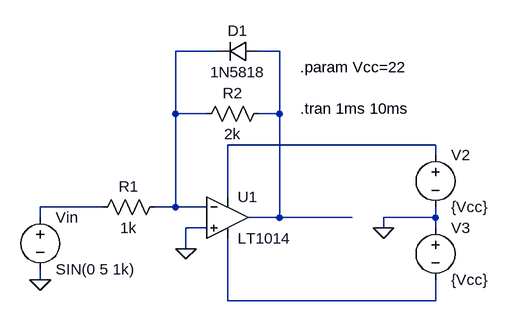
[diagram p0: schematic scheme2.asc]
scheme2.asc, the LTspice schematic file:
Version 4.1
SHEET 1 880 680
WIRE 176 -48 112 -48
WIRE 272 -48 240 -48
WIRE 112 48 112 -48
WIRE 160 48 112 48
WIRE 272 48 272 -48
WIRE 272 48 240 48
WIRE 512 96 192 96
WIRE 512 112 512 96
WIRE 192 176 192 96
WIRE 0 192 -96 192
WIRE 112 192 112 48
WIRE 112 192 80 192
WIRE 160 192 112 192
WIRE -96 208 -96 192
WIRE 272 208 272 48
WIRE 272 208 224 208
WIRE 384 208 272 208
WIRE 512 208 512 192
WIRE 512 208 432 208
WIRE 160 224 128 224
WIRE 432 224 432 208
WIRE 512 224 512 208
WIRE 128 256 128 224
WIRE -96 304 -96 288
WIRE 192 336 192 240
WIRE 512 336 512 304
WIRE 512 336 192 336
FLAG 128 256 0
FLAG -96 304 0
FLAG 432 224 0
SYMBOL res 96 176 R90
WINDOW 0 0 56 VBottom 2
WINDOW 3 32 56 VTop 2
SYMATTR InstName R1
SYMATTR Value 1k
SYMBOL res 256 32 R90
WINDOW 0 0 56 VBottom 2
WINDOW 3 32 56 VTop 2
SYMATTR InstName R2
SYMATTR Value 2k
SYMBOL diode 240 -64 R90
WINDOW 0 0 32 VBottom 2
WINDOW 3 32 32 VTop 2
SYMATTR InstName D1
SYMATTR Value 1N5818
SYMBOL OpAmps\\LT1014 192 144 R0
SYMATTR InstName U1
SYMBOL voltage -96 192 R0
SYMATTR InstName Vin
SYMATTR Value SIN(0 5 1k)
SYMBOL voltage 512 96 R0
SYMATTR InstName V2
SYMATTR Value {Vcc}
SYMBOL voltage 512 208 R0
SYMATTR InstName V3
SYMATTR Value {Vcc}
TEXT 304 -24 Left 2 !.param Vcc=22
TEXT 304 40 Left 2 !.tran 1ms 10ms

The netlist it stands for:
* scheme2.asc
R1 N001 N004 1k
R2 N002 N001 2k
D1 N002 N001 1N5818
X§U1 0 N001 N003 N005 N002 LT1014  ; pins In+ In- V+ V- OUT
Vin N004 0 SIN(0 5 1k)
V2 N003 0 {Vcc}
V3 0 N005 {Vcc}
.model D D
.lib standard.dio
.param Vcc=22
.tran 1ms 10ms
.backanno
.end